# EAGLE design ATmega_Sesnos_Controller (EAGLE 7.2.0)
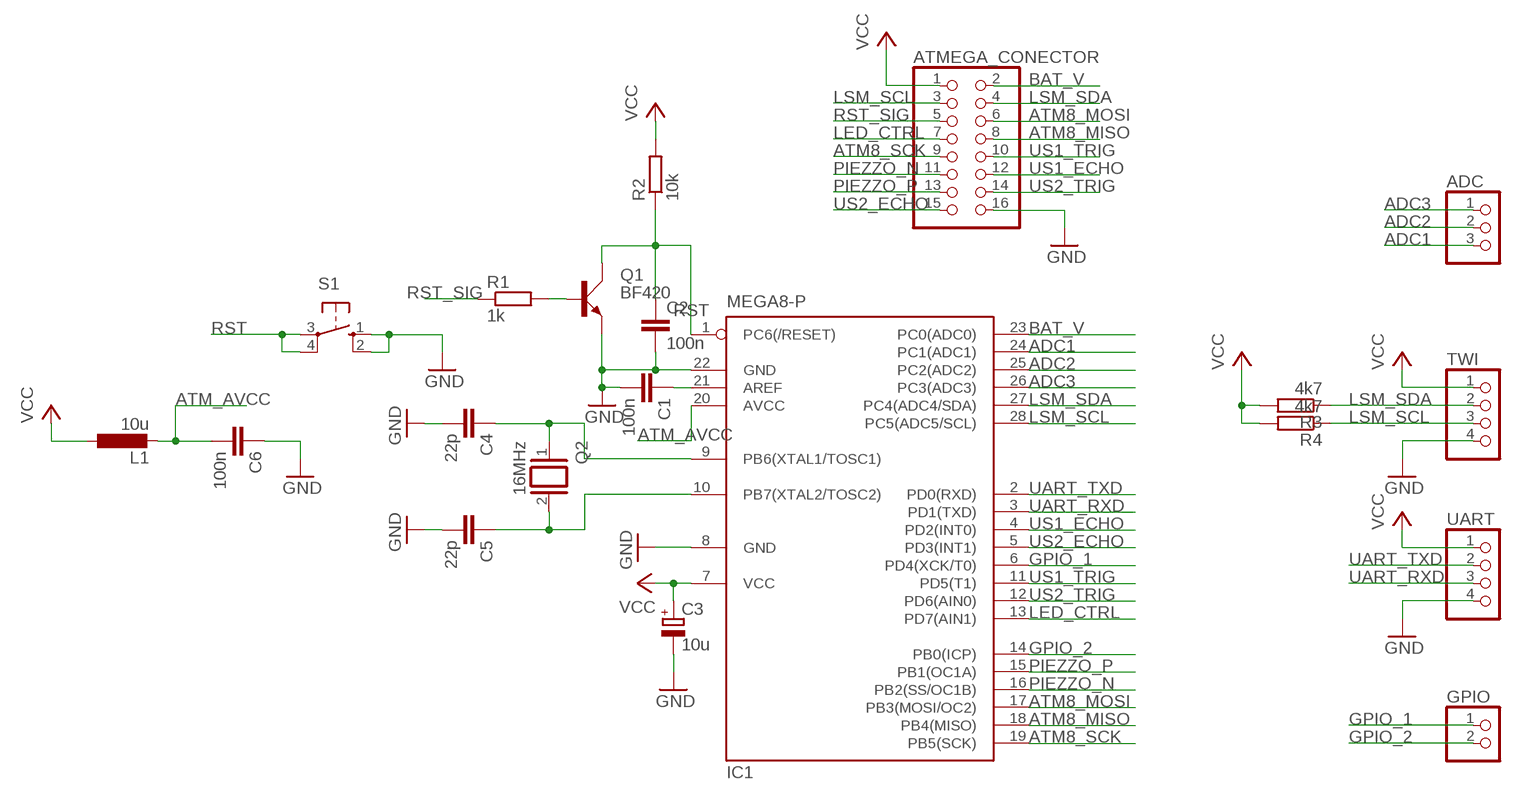
[diagram p0: schematic, sheet 1]

## Parts
ADC  PINHD-1X3/90  [1X03/90]
ATMEGA_CONECTOR  PINHD-2X8  [2X08]
C1  100n  C-EU025-024X044  [C025-024X044]
C2  100n  C-EU025-024X044  [C025-024X044]
C3  10u  CPOL-EUE5-5  [E5-5]
C4  22p  C-EU025-024X044  [C025-024X044]
C5  22p  C-EU025-024X044  [C025-024X044]
C6  100n  C-EU025-024X044  [C025-024X044]
GPIO  PINHD-1X2/90  [1X02/90]
IC1  MEGA8-P  [DIL28-3]
L1  10u  L-EU0204/7  [0204/7]
Q1  BF420  [SOT54D]
Q2  16MHz  XTAL/S  [QS]
R1  1k  R-EU_0309/10  [0309/10]
R2  10k  R-EU_0309/10  [0309/10]
R3  4k7  R-EU_0204/5  [0204/5]
R4  4k7  R-EU_0204/5  [0204/5]
S1  10-XX  [B3F-10XX]
TWI  PINHD-1X4/90  [1X04/90]
UART  PINHD-1X4/90  [1X04/90]

## Nets
ADC1: ADC.3 IC1.24(PC1(ADC1))
ADC2: ADC.2 IC1.25(PC2(ADC2))
ADC3: ADC.1 IC1.26(PC3(ADC3))
ATM8_MISO: ATMEGA_CONECTOR.8 IC1.18(PB4(MISO))
ATM8_MOSI: ATMEGA_CONECTOR.6 IC1.17(PB3(MOSI/OC2))
ATM8_SCK: ATMEGA_CONECTOR.9 IC1.19(PB5(SCK))
ATM_AVCC: C6.2 IC1.20(AVCC) L1.2
BAT_V: ATMEGA_CONECTOR.2 IC1.23(PC0(ADC0))
GND: ATMEGA_CONECTOR.16 C1.2 C2.2 C3.- C4.2 C5.2 C6.1 IC1.8(GND) IC1.22(GND) Q1.E S1.1(S) S1.2(S1) TWI.4 UART.4
GPIO_1: GPIO.1 IC1.6(PD4(XCK/T0))
GPIO_2: GPIO.2 IC1.14(PB0(ICP))
LED_CTRL: ATMEGA_CONECTOR.7 IC1.13(PD7(AIN1))
LSM_SCL: ATMEGA_CONECTOR.3 IC1.28(PC5(ADC5/SCL)) R4.1 TWI.3
LSM_SDA: ATMEGA_CONECTOR.4 IC1.27(PC4(ADC4/SDA)) R3.1 TWI.2
N$1: C1.1 IC1.21(AREF)
N$2: C4.1 IC1.9(PB6(XTAL1/TOSC1)) Q2.1
N$3: C5.1 IC1.10(PB7(XTAL2/TOSC2)) Q2.2
N$4: Q1.B R1.2
PIEZZO_N: ATMEGA_CONECTOR.11 IC1.16(PB2(SS/OC1B))
PIEZZO_P: ATMEGA_CONECTOR.13 IC1.15(PB1(OC1A))
RST: C2.1 IC1.1(PC6(/RESET)) Q1.C R2.1 S1.3(P) S1.4(P1)
RST_SIG: ATMEGA_CONECTOR.5 R1.1
UART_RXD: IC1.3(PD1(TXD)) UART.3
UART_TXD: IC1.2(PD0(RXD)) UART.2
US1_ECHO: ATMEGA_CONECTOR.12 IC1.4(PD2(INT0))
US1_TRIG: ATMEGA_CONECTOR.10 IC1.11(PD5(T1))
US2_ECHO: ATMEGA_CONECTOR.15 IC1.5(PD3(INT1))
US2_TRIG: ATMEGA_CONECTOR.14 IC1.12(PD6(AIN0))
VCC: ATMEGA_CONECTOR.1 C3.+ IC1.7(VCC) L1.1 R2.2 R3.2 R4.2 TWI.1 UART.1

## Library data of the parts
ADC = pinhead:PINHD-1X3: PIN HEADER
ATMEGA_CONECTOR = pinhead:PINHD-2X8: PIN HEADER
C1 C2 C4-C6 = rcl:C-EU: CAPACITOR, European symbol
C3 = rcl:CPOL-EU: POLARIZED CAPACITOR, European symbol
GPIO = pinhead:PINHD-1X2: PIN HEADER
IC1 = atmel:MEGA8-P: MICROCONTROLLER 8 Kbytes FLASH, 1 kbytes SRAM, 512 bytes EEPROM, USART, 4-channel 10 bit ADC, 2-channel 8 bit ADC Pin compatible with Atmega48, ATMega88, ATMega168 Source: avr.lbr; OC_FARNELL: unknown; OC_NEWARK: unknown
L1 = resistor:L-EU: INDUCTOR, European symbol
Q1 = transistor-small-signal:BF420: NPN TRANSISTOR
Q2 = special:XTAL/S: CRYSTAL
R1-R4 = resistor:R-EU_: RESISTOR, European symbol
S1 = switch-omron:10-XX: OMRON SWITCH; MPN: B3F-1000; OC_FARNELL: 176432; OC_NEWARK: 36M3542
TWI UART = pinhead:PINHD-1X4: PIN HEADER

## Board
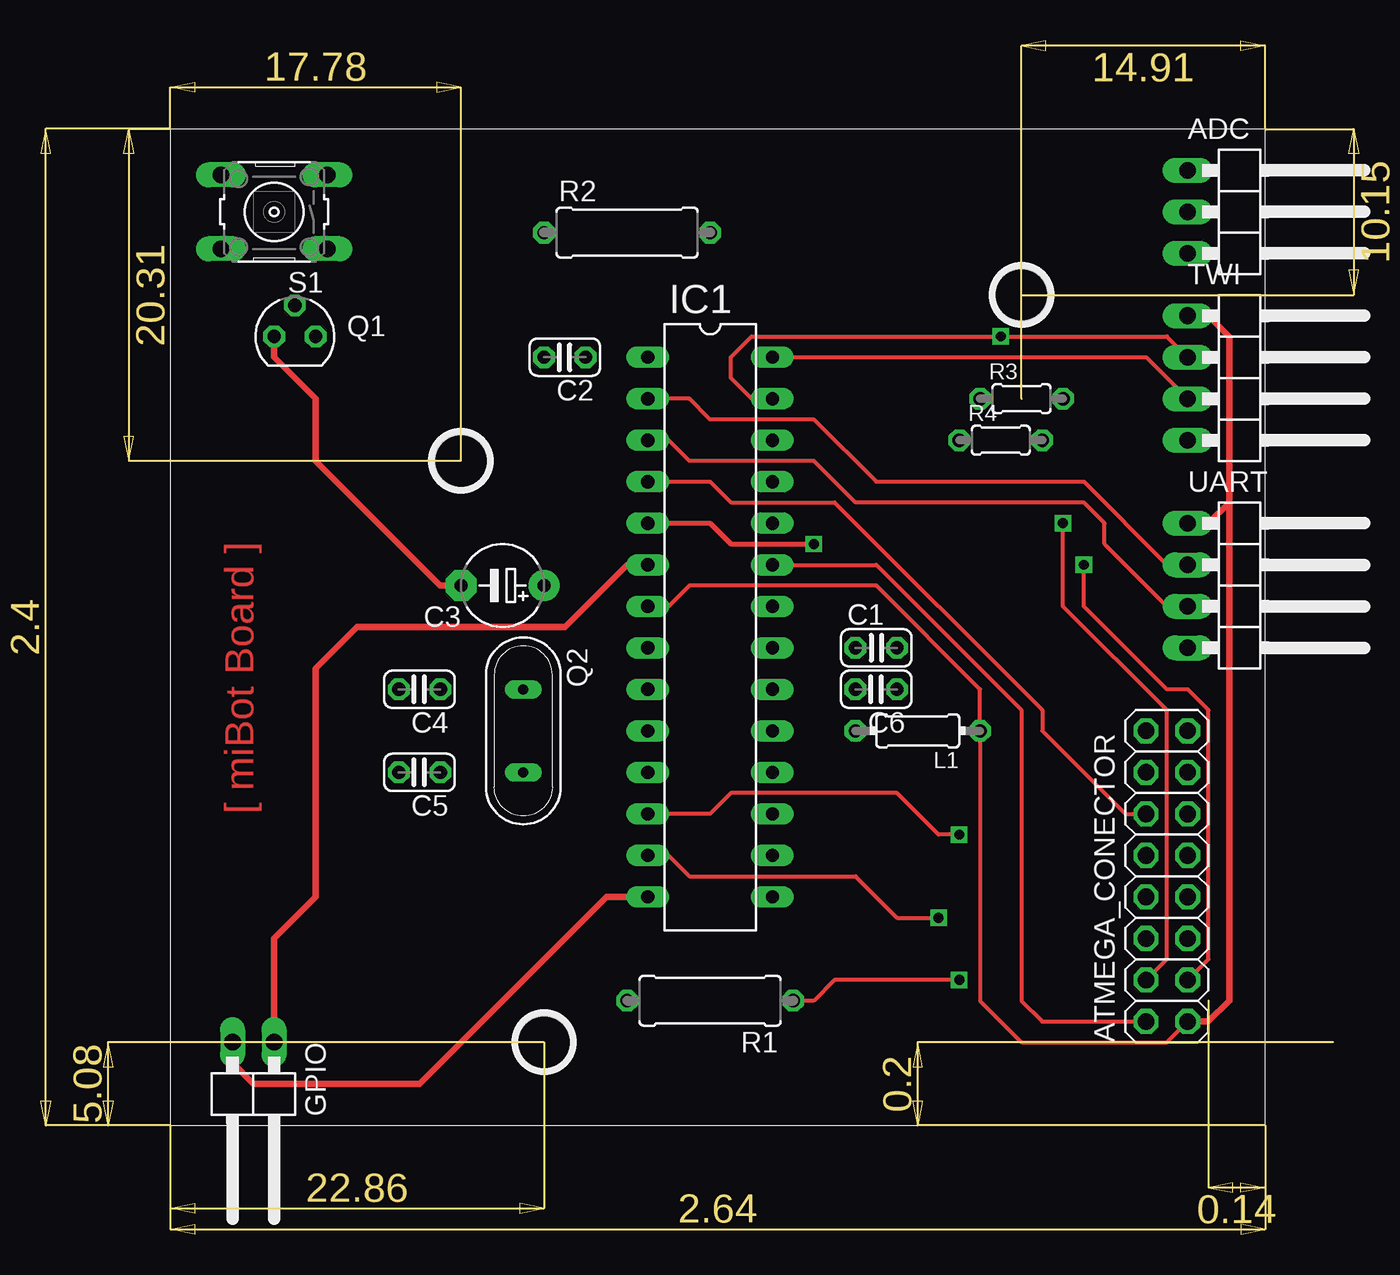
[diagram p1: board, top side]
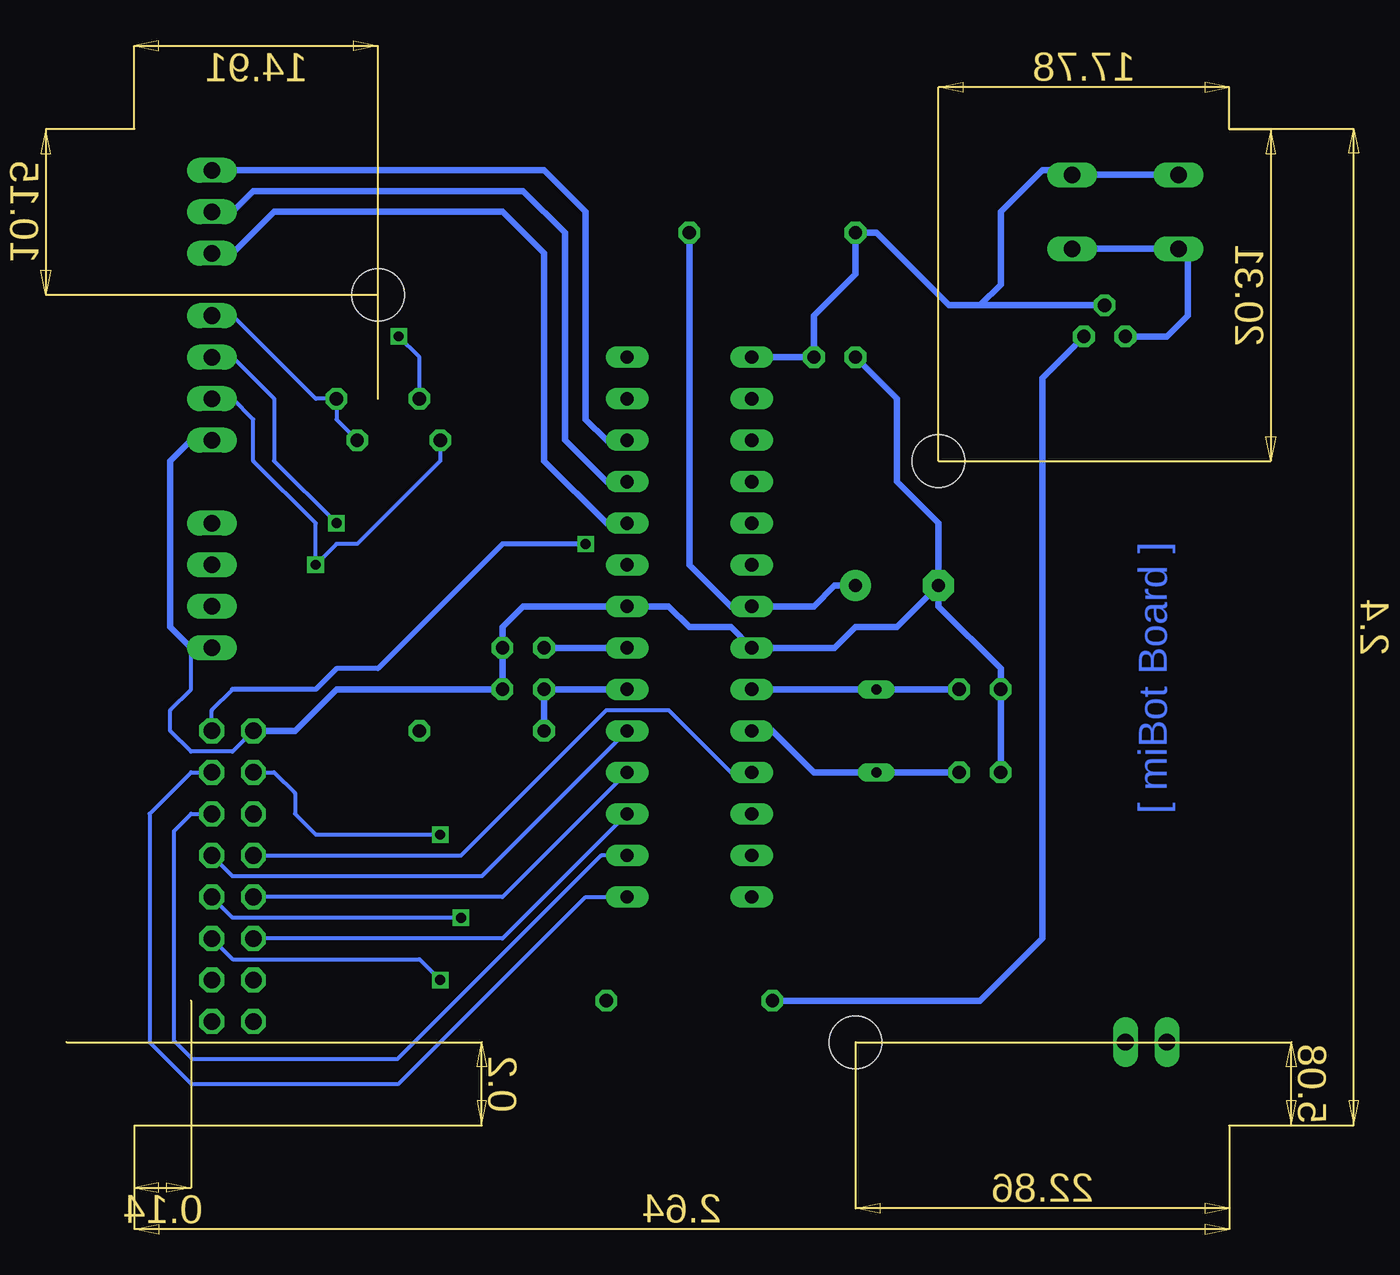
[diagram p2: board, bottom side, seen from below]

Size 80.61 x 72.99 mm. Coordinates in mm from the lower left corner, seen from the top.
Copper layers (1*16): Top 0.035mm / dielectric 1.5mm / Bottom 0.035mm
Design rules "default": minimum track width 10mil, minimum drill 24mil, track to track 8mil, track to pad 8mil, pad to pad 8mil, via to via 8mil, smd to smd 8mil, copper to edge 40mil, drill to drill 8mil, minimum pad ring 10mil, minimum via ring 8mil, stop-mask expansion 4mil, vias tented up to drill 0mil, thermal gap 10mil
Holes 3.2 mm at 30.78,11.73 25.7,47.29 59.99,57.45

### Footprints (pad centres in the part's own frame; a part is rotated, then mirrored left to right if it is on the bottom)
1X03/90 = drill 1.016 long: 1 -2.54,-3.81; 2 0,-3.81; 3 2.54,-3.81
2X08 = drill 1.016 octagon: 1 -8.89,-1.27; 2 -8.89,1.27; 3 -6.35,-1.27; 4 -6.35,1.27; 5 -3.81,-1.27; 6 -3.81,1.27; 7 -1.27,-1.27; 8 -1.27,1.27; 9 1.27,-1.27; 10 1.27,1.27; 11 3.81,-1.27; 12 3.81,1.27; 13 6.35,-1.27; 14 6.35,1.27; 15 8.89,-1.27; 16 8.89,1.27
C025-024X044 = drill 0.813 octagon: 1 -1.27,0; 2 1.27,0
E5-5 = drill 0.813 pad 1.905: + -2.54,0 | drill 0.813 pad 1.905 octagon: - 2.54,0
1X02/90 = drill 1.016 long: 1 -1.27,-3.81; 2 1.27,-3.81
DIL28-3 = drill 0.813 long: 1 -16.51,-3.81; 2 -13.97,-3.81; 3 -11.43,-3.81; 4 -8.89,-3.81; 5 -6.35,-3.81; 6 -3.81,-3.81; 7 -1.27,-3.81; 8 1.27,-3.81; 9 3.81,-3.81; 10 6.35,-3.81; 11 8.89,-3.81; 12 11.43,-3.81; 13 13.97,-3.81; 14 16.51,-3.81; 15 16.51,3.81; 16 13.97,3.81; 17 11.43,3.81; 18 8.89,3.81; 19 6.35,3.81; 20 3.81,3.81; 21 1.27,3.81; 22 -1.27,3.81; 23 -3.81,3.81; 24 -6.35,3.81; 25 -8.89,3.81; 26 -11.43,3.81; 27 -13.97,3.81; 28 -16.51,3.81
0204/7 = drill 0.813 octagon: 1 -3.81,0; 2 3.81,0
SOT54D = drill 0.813 octagon: B 1.27,0; C 0,1.905; E -1.27,0
QS = drill 0.61 long: 1 -2.54,0; 2 2.54,0
0309/10 = drill 0.813 octagon: 1 -5.08,0; 2 5.08,0
0204/5 = drill 0.813 octagon: 1 -2.54,0; 2 2.54,0
B3F-10XX = drill 1.016 long: 1 -3.251,2.261; 2 3.251,2.261; 3 -3.251,-2.261; 4 3.251,-2.261
1X04/90 = drill 1.016 long: 1 -3.81,-3.81; 2 -1.27,-3.81; 3 1.27,-3.81; 4 3.81,-3.81

### Placement (x,y rotation side)
ADC  73.96,62.53 270 top
ATMEGA_CONECTOR  68.88,21.89 90 top
C1  51.1,35.86 0 top
C2  32.05,53.64 180 top
C3  28.24,39.67 180 top
C4  23.16,33.32 180 top
C5  23.16,28.24 180 top
C6  51.1,33.32 180 top
GPIO  13,7.92 180 top
IC1  40.94,37.13 270 top
L1  53.64,30.78 180 top
Q1  15.54,54.91 0 top
Q2  29.51,30.78 270 top
R1  40.94,14.27 180 top
R2  35.86,61.26 0 top
R3  59.99,51.1 0 top
R4  58.72,48.56 0 top
S1  14.27,62.53 180 top
TWI  73.96,52.37 270 top
UART  73.96,39.67 270 top

### Tracks (layer width: path | path; a pad name or v marks a point on that pad's centre or on a via)
ADC1
  Bottom 0.406: IC1.24 46.02,43.48 49.83,47.29 49.83,59.99 52.37,62.53 66.34,62.53 68.88,59.99 ADC.3
ADC2
  Bottom 0.406: IC1.25 46.02,46.02 48.56,48.56 48.56,61.26 51.1,63.8 67.61,63.8 68.88,62.53 ADC.2
ADC3
  Bottom 0.406: IC1.26 46.02,48.56 47.29,49.83 47.29,62.53 49.83,65.07 ADC.1
ATM8_MISO
  Bottom 0.254: IC1.18 52.37,20.62 ATMEGA_CONECTOR.8
ATM8_MOSI
  Bottom 0.254: IC1.17 52.37,18.08 ATMEGA_CONECTOR.6
ATM8_SCK
  Bottom 0.254: IC1.19 53.64,21.89 68.88,21.89 ATMEGA_CONECTOR.9
ATM_AVCC
  Bottom 0.406: L1.2 C6.2 IC1.20
BAT_V
  Top 0.254: IC1.23 51.1,40.94 59.99,32.05 59.99,14.27 61.26,13 ATMEGA_CONECTOR.2
GND
  Top 0.406: Q1.E 14.27,53.64 16.81,51.1 16.81,47.29 24.43,39.67 C3.-
  Bottom 0.254: ATMEGA_CONECTOR.16 68.88,29.51 71.42,29.51 72.69,30.78 72.69,32.05 71.42,33.32 71.42,35.86
  Bottom 0.406: ATMEGA_CONECTOR.16 65.07,30.78 62.53,33.32 C6.1 C1.2 52.37,37.13 51.1,38.4 IC1.22 42.21,38.4 40.94,37.13 38.4,37.13 IC1.8 32.05,35.86 30.78,37.13 28.24,37.13 C3.- | C5.2 C4.2 21.89,34.59 25.7,38.4 C3.- | Q1.E 11.73,54.91 10.46,56.18 10.46,59.71 S1.2 S1.1 | C3.- 25.7,43.48 28.24,46.02 28.24,51.1 C2.2 | TWI.4 71.42,48.56 72.69,47.29 72.69,37.13 71.42,35.86 UART.4
GPIO_1
  Top 0.406: GPIO.1 14.27,18.08 16.81,20.62 16.81,34.59 19.35,37.13 32.05,37.13 35.86,40.94 IC1.6
GPIO_2
  Top 0.406: GPIO.2 11.73,10.46 13,9.19 23.16,9.19 34.59,20.62 IC1.14
LED_CTRL  (via drill 0.61)
  Top 0.254: IC1.13 38.4,23.16 39.67,21.89 49.83,21.89 52.37,19.35 v54.91,19.35
  Bottom 0.254: v54.91,19.35 68.88,19.35 ATMEGA_CONECTOR.7
LSM_SCL  (via drill 0.61)
  Top 0.254: IC1.28 67.61,53.64 TWI.3 | ATMEGA_CONECTOR.3 71.42,16.81 71.42,32.05 70.15,33.32 68.88,33.32 63.8,38.4 v63.8,40.94
  Bottom 0.254: TWI.3 68.88,51.1 67.61,49.83 67.61,47.29 63.8,43.48 v63.8,40.94 62.53,42.21 61.26,42.21 56.18,47.29 R4.1
LSM_SDA  (via drill 0.6, 0.61)
  Top 0.254: IC1.27 43.48,51.1 42.21,52.37 42.21,53.64 43.48,54.91 v58.72,54.91 68.88,54.91 TWI.2 | ATMEGA_CONECTOR.4 68.88,16.81 68.88,32.05 62.53,38.4 v62.53,43.48
  Bottom 0.254: TWI.2 68.88,53.64 66.34,51.1 66.34,47.29 v62.53,43.48 | R3.1 57.45,53.64 v58.72,54.91
N$1
  Bottom 0.406: C1.1 IC1.21
N$2
  Bottom 0.406: C4.1 Q2.1 IC1.9
N$3
  Bottom 0.406: C5.1 Q2.2 33.32,28.24 35.86,30.78 IC1.10
N$4
  Bottom 0.406: R1.2 23.16,14.27 19.35,18.08 19.35,52.37 Q1.B
PIEZZO_N
  Bottom 0.254: IC1.16 46.34,23.16 58.82,10.69 71.33,10.69 72.46,11.82 72.46,24.66 71.42,25.7 ATMEGA_CONECTOR.11
PIEZZO_P
  Bottom 0.254: ATMEGA_CONECTOR.13 71.42,28.24 73.96,25.7 73.96,11.73 71.42,9.19 58.72,9.19 47.29,20.62 IC1.15
RST
  Bottom 0.406: S1.4 S1.3 17.8,65.07 19.35,65.07 21.89,62.53 21.89,58.09 23.16,56.81 | 23.16,56.81 Q1.C 19.98,56.81 | 23.16,56.81 25.06,56.81 29.51,61.26 R2.1 30.78,58.72 33.32,56.18 C2.1 IC1.1
RST_SIG  (via drill 0.6)
  Top 0.254: v56.18,15.54 48.56,15.54 47.29,14.27 R1.1
  Bottom 0.254: ATMEGA_CONECTOR.5 68.88,16.81 57.45,16.81 v56.18,15.54
UART_RXD
  Top 0.254: IC1.3 38.4,48.56 39.67,47.29 47.29,47.29 49.83,44.75 63.8,44.75 65.07,43.48 65.07,42.21 68.88,38.4 UART.3
UART_TXD
  Top 0.254: UART.2 68.88,40.94 63.8,46.02 51.1,46.02 47.29,49.83 40.94,49.83 39.67,51.1 IC1.2
US1_ECHO
  Top 0.254: IC1.4 40.94,46.02 42.21,44.75 48.56,44.75 61.26,32.05 61.26,30.78 66.34,25.7 ATMEGA_CONECTOR.12
US1_TRIG
  Bottom 0.254: ATMEGA_CONECTOR.10 54.91,23.16 46.02,32.05 42.21,32.05 38.4,28.24 IC1.11
US2_ECHO  (via drill 0.6)
  Top 0.305: IC1.5 40.94,43.48 42.21,42.21 v47.29,42.21
  Bottom 0.254: ATMEGA_CONECTOR.15 70.15,32.05 68.88,33.32
  Bottom 0.305: v47.29,42.21 52.37,42.21 59.99,34.59 62.53,34.59 63.8,33.32 68.88,33.32
US2_TRIG  (via drill 0.61)
  Top 0.254: v56.18,24.43 54.91,24.43 52.37,26.97 42.21,26.97 40.94,25.7 IC1.12
  Bottom 0.254: ATMEGA_CONECTOR.14 66.34,28.24 65.07,26.97 65.07,25.7 63.8,24.43 v56.18,24.43
VCC
  Top 0.254: ATMEGA_CONECTOR.1 68.88,11.73 59.99,11.73 57.45,14.27 L1.1 57.45,33.32 51.1,39.67 39.67,39.67 38.4,38.4 IC1.7
  Top 0.406: TWI.1 71.42,56.18 72.69,54.91 72.69,44.75 | UART.1 71.42,43.48 72.69,44.75 | ATMEGA_CONECTOR.1 71.42,13 72.69,14.27 72.69,44.75
  Bottom 0.254: TWI.1 68.88,56.18 63.8,51.1 R3.2 62.53,49.83 R4.2
  Bottom 0.406: R2.2 40.94,40.94 38.4,38.4 IC1.7 33.32,38.4 32.05,39.67 C3.+

### Text on the board
Top: [ miBot Board ]
Bottom: [ miBot Board ]